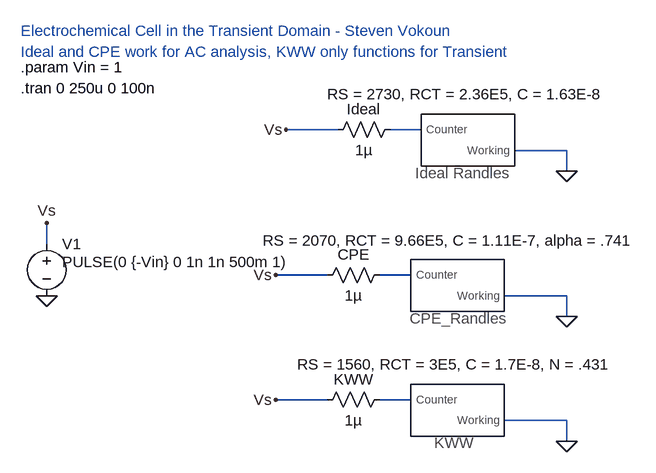
[diagram p0: schematic Three Models.asc]
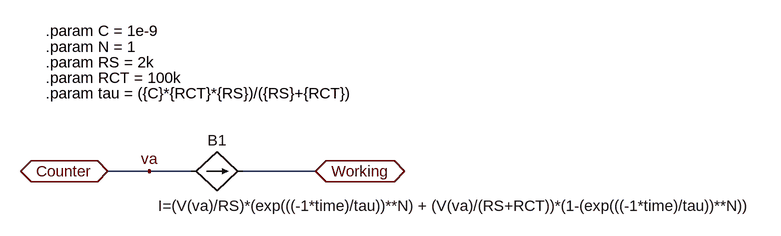
[diagram p1: sub-circuit kww_arbitrarycurrentsource.asc]
Three Models.asc, the LTspice schematic file:
Version 4
SHEET 1 880 680
WIRE 256 144 176 144
WIRE 384 144 336 144
WIRE 608 176 528 176
WIRE 608 208 608 176
WIRE -192 320 -192 288
WIRE 240 368 160 368
WIRE 368 368 320 368
WIRE 608 400 512 400
WIRE 608 432 608 400
WIRE 240 560 160 560
WIRE 368 560 320 560
WIRE 608 592 512 592
WIRE 608 624 608 592
FLAG -192 400 0
FLAG -192 288 Vs
FLAG 608 208 0
FLAG 608 432 0
FLAG 160 368 Vs
FLAG 176 144 Vs
FLAG 608 624 0
FLAG 160 560 Vs
SYMBOL Ideal_Randles 448 160 R0
WINDOW 0 8 -40 Invisible 2
WINDOW 39 4 -55 Bottom 2
SYMATTR InstName X1
SYMATTR SpiceLine RS = 2730, RCT = 2.36E5, C = 1.63E-8
SYMBOL voltage -192 304 R0
WINDOW 3 24 44 Left 2
WINDOW 123 24 44 Left 2
WINDOW 39 0 0 Left 0
SYMATTR Value PULSE(0 {-Vin} 0 1n 1n 500m 1)
SYMATTR InstName V1
SYMBOL CPE_Randles 432 384 R0
WINDOW 0 8 -40 Invisible 2
WINDOW 39 -5 -54 Bottom 2
SYMATTR InstName X2
SYMATTR SpiceLine RS = 2070, RCT = 9.66E5, C = 1.11E-7, alpha = .741
SYMBOL res 336 352 R90
WINDOW 0 0 56 VBottom 2
WINDOW 3 32 56 VTop 2
SYMATTR InstName CPE
SYMATTR Value 1µ
SYMBOL res 352 128 R90
WINDOW 0 0 56 VBottom 2
WINDOW 3 32 56 VTop 2
SYMATTR InstName Ideal
SYMATTR Value 1µ
SYMBOL KWW_ArbitraryCurrentSource 432 576 R0
WINDOW 0 8 -40 Invisible 2
WINDOW 39 3 -55 Bottom 2
SYMATTR InstName X3
SYMATTR SpiceLine RS = 1560, RCT = 3E5, C = 1.7E-8, N = .431
SYMBOL res 336 544 R90
WINDOW 0 0 56 VBottom 2
WINDOW 3 32 56 VTop 2
SYMATTR InstName KWW
SYMATTR Value 1µ
TEXT -232 80 Left 2 !.tran 0 250u 0 100n
TEXT -232 48 Left 2 !.param Vin = 1
TEXT -232 -8 Left 2 ;Electrochemical Cell in the Transient Domain - Steven Vokoun
TEXT -232 24 Left 2 ;Ideal and CPE work for AC analysis, KWW only functions for Transient

kww_arbitrarycurrentsource.asc, the sub-circuit schematic file:
Version 4
SHEET 1 1320 680
WIRE 288 96 224 96
WIRE 352 96 288 96
WIRE 544 96 432 96
FLAG 224 96 Counter
IOPIN 224 96 BiDir
FLAG 544 96 Working
IOPIN 544 96 BiDir
FLAG 288 96 va
SYMBOL bi 352 96 R270
WINDOW 0 32 40 VTop 2
WINDOW 3 -37 413 VBottom 2
SYMATTR InstName B1
SYMATTR Value I=(V(va)/RS)*(exp(((-1*time)/tau))**N) + (V(va)/(RS+RCT))*(1-(exp(((-1*time)/tau))**N))
TEXT 128 -120 Left 2 !.param C = 1e-9
TEXT 128 -96 Left 2 !.param N = 1
TEXT 128 -72 Left 2 !.param RS = 2k
TEXT 128 -48 Left 2 !.param RCT = 100k
TEXT 128 -24 Left 2 !.param tau = ({C}*{RCT}*{RS})/({RS}+{RCT})

The netlist it stands for:
* Three Models.asc
XX1 N001 0 Ideal_Randles params: RS = 2730, RCT = 2.36E5, C = 1.63E-8  ; pins Counter Working
V1 Vs 0 PULSE(0 {-Vin} 0 1n 1n 500m 1)
XX2 N002 0 CPE_Randles params: RS = 2070, RCT = 9.66E5, C = 1.11E-7, alpha = .741  ; pins Counter Working
R§CPE N002 Vs 1µ
R§Ideal N001 Vs 1µ
XX3 N003 0 kww_arbitrarycurrentsource params: RS = 1560, RCT = 3E5, C = 1.7E-8, N = .431
R§KWW N003 Vs 1µ

* block symbol definitions
.subckt kww_arbitrarycurrentsource Counter Working
B1 Counter Working I=(V(va)/RS)*(exp(((-1*time)/tau))**N) + (V(va)/(RS+RCT))*(1-(exp(((-1*time)/tau))**N))
.param C = 1e-9
.param N = 1
.param RS = 2k
.param RCT = 100k
.param tau = ({C}*{RCT}*{RS})/({RS}+{RCT})
.ends kww_arbitrarycurrentsource

.tran 0 250u 0 100n
.param Vin = 1
* Electrochemical Cell in the Transient Domain - Steven Vokoun
* Ideal and CPE work for AC analysis, KWW only functions for Transient
.backanno
.end